# EAGLE design Rainbowduino V3.0b (EAGLE 5.11)
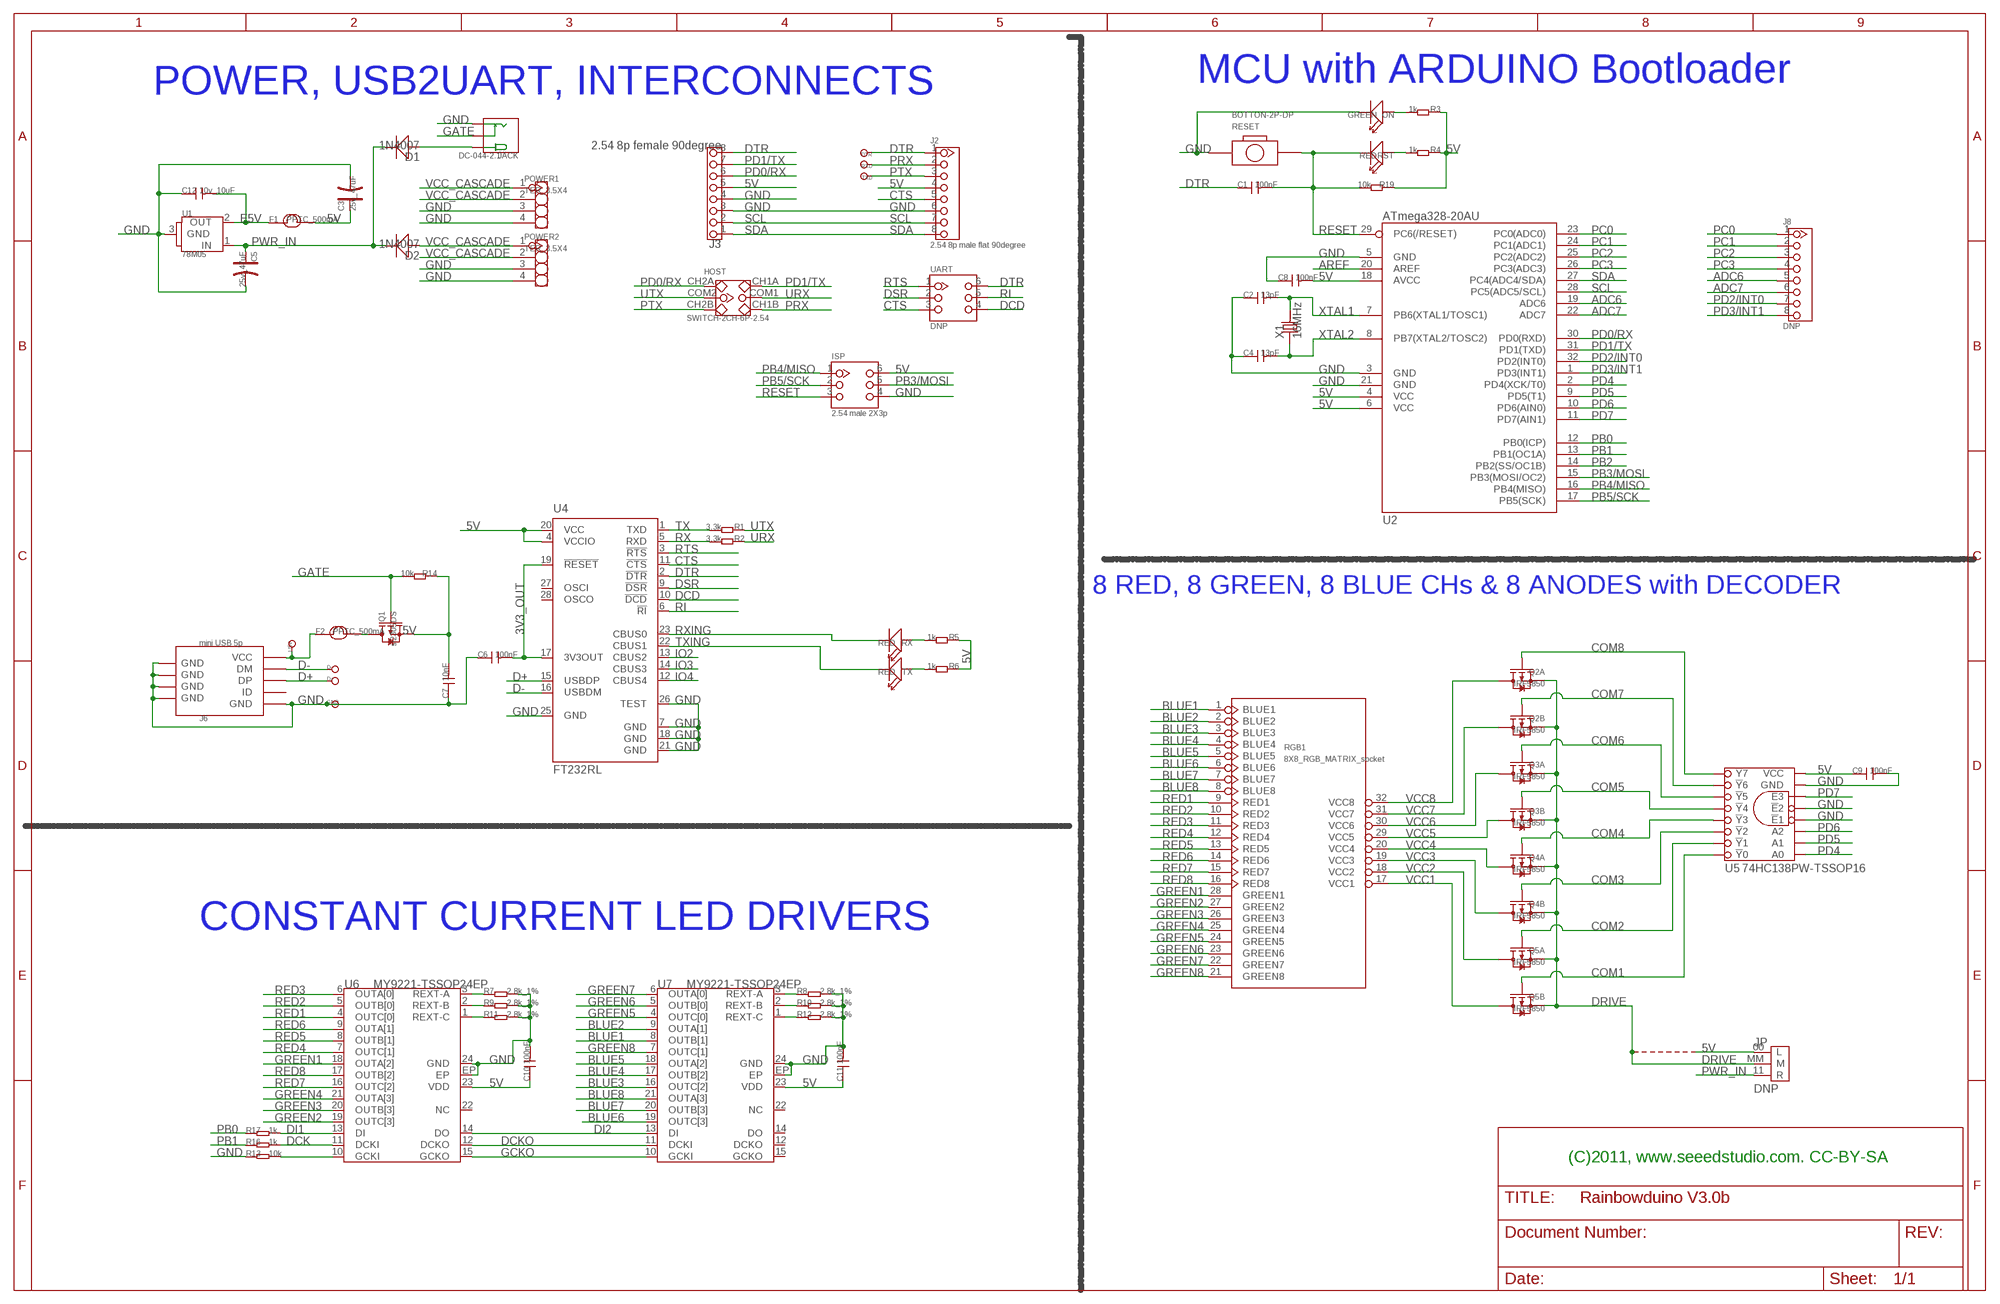
[diagram p0: schematic, sheet 1]

## Parts
C1  100nF  C-0402  [0402]
C2  13pF  C-0402  [0402]
C3  25v_47uF  CAP_ELECTRO_C  [ELECTRO-SMD-C]
C4  13pF  C-0402  [0402]
C5  25v_47uF  CAP_ELECTRO_C  [ELECTRO-SMD-C]
C6  100nF  C-0402  [0402]
C7  10nF  C-0402  [0402]
C8  100nF  C-0402  [0402]
C9  100nF  C-0402  [0402]
C10  100nF  C-0402  [0402]
C11  100nF  C-0402  [0402]
C12  10v_10uF  C-0805  [0805]
D1  1N4007  D-2010  [D2010]
D2  1N4007  D-2010  [D2010]
D+  TEST_POINT_SIZE_3030  [TP_3535]
D-  TEST_POINT_SIZE_3030  [TP_3535]
DTR  TEST_POINT_SIZE_3030  [TP_3535]
F1  PPTC_500mA  FUSE  [1206]
F2  PPTC_500mA  FUSE  [1206]
GND  TEST_POINT_SIZE_3030  [TP_3535]
HOST  SWITCH-2CH-6P-2.54  [2.54SW-2CH]
ISP  2.54 male 2X3p  CK_2X3_DD  [CK_2X3]
J2  2.54 8p male flat 90degree  HEADER-8P-M90  [8P-2.54-MALE-90-LEADED]
J3  2.54 8p female 90degree  8PF90D  [2.54_8P_F90D]
J6  mini USB 5p  USB-MINIUSB-5P_STRONG  [MINI_STRONG]
J8  DNP  HEADER-8P-2.54-LEADED  [8P-2.54-LEADED]
JACK  DC-044-2.1  DC-044  [DC-404]
JP  DNP  PAD-JUMPER-3P40*40  [JUMPER]
ON  GREEN  LED-0603  [D0603]
POWER1  TER_3.5X4  [TER_3.5X4]
POWER2  TER_3.5X4  [TER_3.5X4]
Q1  si2305DS  MOSFET-P-SOT23  [SOT23_]
Q2  IRF5850  DUAL-P-CH-TSOP-6  [TSOP-6]
Q3  IRF5850  DUAL-P-CH-TSOP-6  [TSOP-6]
Q4  IRF5850  DUAL-P-CH-TSOP-6  [TSOP-6]
Q5  IRF5850  DUAL-P-CH-TSOP-6  [TSOP-6]
R1  3.3k  R-0402  [0402]
R2  3.3k  R-0402  [0402]
R3  1k  R-0402  [0402]
R4  1k  R-0402  [0402]
R5  1k  R-0402  [0402]
R6  1k  R-0402  [0402]
R7  2.8k_1%  R-0603  [0603]
R8  2.8k_1%  R-0603  [0603]
R9  2.8k_1%  R-0603  [0603]
R10  2.8k_1%  R-0603  [0603]
R11  2.8k_1%  R-0603  [0603]
R12  2.8k_1%  R-0603  [0603]
R13  10k  R-0402  [0402]
R14  10k  R-0402  [0402]
R16  1k  R-0402  [0402]
R17  1k  R-0402  [0402]
R19  10k  R-0402  [0402]
RESET  BOTTON-2P-DP  [BTN-5.0-RST]
RGB1  8X8_RGB_MATRIX_socket  8X8_RGB_MATRIX  [8X8_RGB_MATRIX]
RST  RED  LED-0603  [D0603]
RX  RED  LED-0603  [D0603]
RXD  TEST_POINT_SIZE_3030  [TP_3535]
TX  RED  LED-0603  [D0603]
TXD  TEST_POINT_SIZE_3030  [TP_3535]
U1  78M05  78M05-TO252  [TO252]
U2  ATmega328-20AU  ATMEGA168  [TQFP32]
U4  FT232RL  [SSOP28]
U5  74HC138PW-TSSOP16  [TSSOP16]
U5V  TEST_POINT_SIZE_3030  [TP_3535]
U6  MY9221-TSSOP24EP  [TSSOP24EP]
U7  MY9221-TSSOP24EP  [TSSOP24EP]
UART  DNP  CK_2X3_DD  [CK_2X3]
X1  16MHz  CRYSTAL-5032  [5032]

## Nets
3V3_OUT: C6.2 U4.17(3V3OUT) U4.19(!RESET)
5V: C3.+ C7.2 C8.2 C9.1 C10.1 C11.1 F1.2 ISP.6 J2.4 J3.5 JP.00(L) Q1.2(S) R3.1 R4.1 R5.1 R6.1 R14.1 R19.1 U2.4(VCC) U2.6(VCC) U2.18(AVCC) U4.4(VCCIO) U4.20(VCC) U5.16(VCC) U6.23(VDD) U7.23(VDD)
ADC6: J8.5 U2.19(ADC6)
ADC7: J8.6 U2.22(ADC7)
AREF: U2.20(AREF)
BLUE1: RGB1.1(BLUE1) U7.8(OUTB[1])
BLUE2: RGB1.2(BLUE2) U7.9(OUTA[1])
BLUE3: RGB1.3(BLUE3) U7.16(OUTC[2])
BLUE4: RGB1.4(BLUE4) U7.17(OUTB[2])
BLUE5: RGB1.5(BLUE5) U7.18(OUTA[2])
BLUE6: RGB1.6(BLUE6) U7.19(OUTC[3])
BLUE7: RGB1.7(BLUE7) U7.20(OUTB[3])
BLUE8: RGB1.8(BLUE8) U7.21(OUTA[3])
COM1: Q5.3(B:G) U5.15(!Y!0)
COM2: Q5.1(A:G) U5.14(!Y!1)
COM3: Q4.3(B:G) U5.13(!Y!2)
COM4: Q4.1(A:G) U5.12(!Y!3)
COM5: Q3.3(B:G) U5.11(!Y!4)
COM6: Q3.1(A:G) U5.10(!Y!5)
COM7: Q2.3(B:G) U5.9(!Y!6)
COM8: Q2.1(A:G) U5.7(!Y!7)
CTS: J2.5 U4.11(!CTS) UART.3
D+: D+.T J6.3(DP) U4.15(USBDP)
D-: D-.T J6.2(DM) U4.16(USBDM)
DCD: U4.10(!DCD) UART.4
DCK: R16.2 U6.11(DCKI)
DCKO: U6.12(DCKO) U7.11(DCKI)
DI1: R17.2 U6.13(DI)
DI2: U6.14(DO) U7.13(DI)
DRIVE: JP.MM(M) Q2.2(B:S) Q2.5(A:S) Q3.2(B:S) Q3.5(A:S) Q4.2(B:S) Q4.5(A:S) Q5.2(B:S) Q5.5(A:S)
DSR: U4.9(!DSR) UART.2
DTR: C1.1 DTR.T J2.1 J3.8 U4.2(!DTR) UART.6
E5V: C12.2 F1.1 U1.2(OUT)
GATE: JACK.CDN Q1.1(G) R14.2
GCKO: U6.15(GCKO) U7.10(GCKI)
GND: C2.1 C3.- C4.1 C5.- C6.1 C7.1 C8.1 C9.2 C10.2 C11.2 C12.1 GND.T ISP.4 J2.6 J3.3 J3.4 J6.5(GND) J6.GND@1(GND) J6.GND@2(GND) J6.GND@3(GND) J6.GND@4(GND) JACK.- ON.- POWER1.3 POWER1.4 POWER2.3 POWER2.4 R7.2 R8.2 R9.2 R10.2 R11.2 R12.2 R13.1 RESET.P$1 U1.3(GND) U2.3(GND) U2.5(GND) U2.21(GND) U4.7(GND) U4.18(GND) U4.21(GND) U4.25(GND) U4.26(TEST) U5.4(!E!1) U5.5(!E!2) U5.8(GND) U6.24(GND) U6.EP U7.24(GND) U7.EP
GREEN1: RGB1.28(GREEN1) U6.18(OUTA[2])
GREEN2: RGB1.27(GREEN2) U6.19(OUTC[3])
GREEN3: RGB1.26(GREEN3) U6.20(OUTB[3])
GREEN4: RGB1.25(GREEN4) U6.21(OUTA[3])
GREEN5: RGB1.24(GREEN5) U7.4(OUTC[0])
GREEN6: RGB1.23(GREEN6) U7.5(OUTB[0])
GREEN7: RGB1.22(GREEN7) U7.6(OUTA[0])
GREEN8: RGB1.21(GREEN8) U7.7(OUTC[1])
IO2: U4.13(CBUS2)
IO3: U4.14(CBUS3)
IO4: U4.12(CBUS4)
N$1: D1.+ JACK.+
N$4: R13.2 U6.10(GCKI)
N$5: R6.2 TX.+
N$6: R5.2 RX.+
N$7: R11.1 U6.1(REXT-C)
N$8: R9.1 U6.2(REXT-B)
N$9: R7.1 U6.3(REXT-A)
N$11: R12.1 U7.1(REXT-C)
N$12: R10.1 U7.2(REXT-B)
N$13: R8.1 U7.3(REXT-A)
N$15: F2.1 J6.1(VCC) U5V.T
N$16: F2.2 Q1.3(D)
N$17: R4.2 RST.+
N$18: ON.+ R3.2
PB0: R17.1 U2.12(PB0(ICP))
PB1: R16.1 U2.13(PB1(OC1A))
PB2: U2.14(PB2(SS/OC1B))
PB3/MOSI: ISP.5 U2.15(PB3(MOSI/OC2))
PB4/MISO: ISP.1 U2.16(PB4(MISO))
PB5/SCK: ISP.2 U2.17(PB5(SCK))
PC0: J8.1 U2.23(PC0(ADC0))
PC1: J8.2 U2.24(PC1(ADC1))
PC2: J8.3 U2.25(PC2(ADC2))
PC3: J8.4 U2.26(PC3(ADC3))
PD0/RX: HOST.CH2A J3.6 U2.30(PD0(RXD))
PD1/TX: HOST.CH1A J3.7 U2.31(PD1(TXD))
PD2/INT0: J8.7 U2.32(PD2(INT0))
PD3/INT1: J8.8 U2.1(PD3(INT1))
PD4: U2.2(PD4(XCK/T0)) U5.1(A0)
PD5: U2.9(PD5(T1)) U5.2(A1)
PD6: U2.10(PD6(AIN0)) U5.3(A2)
PD7: U2.11(PD7(AIN1)) U5.6(E3)
PRX: HOST.CH1B J2.2 RXD.T
PTX: HOST.CH2B J2.3 TXD.T
PWR_IN: C5.+ D1.- D2.- JP.11(R) U1.1(IN)
RED1: RGB1.9(RED1) U6.4(OUTC[0])
RED2: RGB1.10(RED2) U6.5(OUTB[0])
RED3: RGB1.11(RED3) U6.6(OUTA[0])
RED4: RGB1.12(RED4) U6.7(OUTC[1])
RED5: RGB1.13(RED5) U6.8(OUTB[1])
RED6: RGB1.14(RED6) U6.9(OUTA[1])
RED7: RGB1.15(RED7) U6.16(OUTC[2])
RED8: RGB1.16(RED8) U6.17(OUTB[2])
RESET: C1.2 ISP.3 R19.2 RESET.P$2 RST.- U2.29(PC6(/RESET))
RI: U4.6(!RI) UART.5
RTS: U4.3(!RTS) UART.1
RX: R2.2 U4.5(RXD)
RXING: RX.- U4.23(CBUS0)
SCL: J2.7 J3.2 U2.28(PC5(ADC5/SCL))
SDA: J2.8 J3.1 U2.27(PC4(ADC4/SDA))
TX: R1.2 U4.1(TXD)
TXING: TX.- U4.22(CBUS1)
URX: HOST.COM1 R2.1
UTX: HOST.COM2 R1.1
VCC1: Q5.4(B:D) RGB1.17(VCC1)
VCC2: Q5.6(A:D) RGB1.18(VCC2)
VCC3: Q4.4(B:D) RGB1.19(VCC3)
VCC4: Q4.6(A:D) RGB1.20(VCC4)
VCC5: Q3.4(B:D) RGB1.29(VCC5)
VCC6: Q3.6(A:D) RGB1.30(VCC6)
VCC7: Q2.4(B:D) RGB1.31(VCC7)
VCC8: Q2.6(A:D) RGB1.32(VCC8)
VCC_CASCADE: D2.+ POWER1.1 POWER1.2 POWER2.1 POWER2.2
XTAL1: C2.2 U2.7(PB6(XTAL1/TOSC1)) X1.2
XTAL2: C4.2 U2.8(PB7(XTAL2/TOSC2)) X1.1
Unconnected: J6.4(ID) U4.27(OSCI) U4.28(OSCO) U6.22(NC) U7.12(DCKO) U7.14(DO) U7.15(GCKO) U7.22(NC)

## Notes on the sheet
- POWER, USB2UART, INTERCONNECTS | MCU with ARDUINO Bootloader
- 8 RED, 8 GREEN, 8 BLUE CHs & 8 ANODES with DECODER
- CONSTANT CURRENT LED DRIVERS
- (C)2011, www.seeedstudio.com. CC-BY-SA

## Library data of the parts
C1 C2 C4 C6-C12 = Discrete:C*: Ceramic Capacitors
C3 C5 = Discrete:CAP*: Electrolytic Capacitors,Tantalum Capacitors and Super Capacitors
D1 D2 = Discrete:D*
D+ D- DTR GND RXD TXD U5V = For_Test_Albert:TEST_POINT
F1 F2 = Discrete:FUSE
HOST = Discrete:SWITCH-2CH-6P
ISP UART = CONNECTER:CK_2X3
J2 J8 = Connector:HEADER-8P
J3 = For_Test_Albert:8P
J6 = Connector:USB-MINIUSB-5P
JACK = Connector:DC-044
JP = Discrete:PAD-JUMPER-3P
ON RST RX TX = Discrete:LED*
POWER1 POWER2 = CONNECTER:TER_3.5X4
Q1 = Discrete:MOSFET-P: Si2305DS Si2323CDS
Q2-Q5 = For_Test_Albert:DUAL-P-CH: NTGD4161 --> http://www.onsemi.cn/pub_link/Collateral/NTGD4161P-D.PDF Si3993DV --> http://www.vishay.com/docs/72320/72320.pdf
R1-R14 R16 R17 R19 = Discrete:R*
RESET = Discrete:BOTTON-2P
RGB1 = EXT_moudle:8X8_RGB_MATRIX
U1 = IC:78M05: http://search.digikey.com/scripts/DkSearch/dksus.dll?Detail&name=MC78M05CDTXTR-ND
U2 = IC:ATMEGA168
U4 = IC_SMD:FT232R: Source: http://www.ftdichip.com/Documents/DataSheets/DS_FT232R_v104.pdf
U5 = For_Test_Albert:74HC138*
U6 U7 = For_Test_Albert:MY9221
X1 = Discrete:CRYSTAL*: CRYSTAL

## Net classes
0 default: width 0.203 mm, drill 0.305 mm, clearance 0.152 mm

## Board
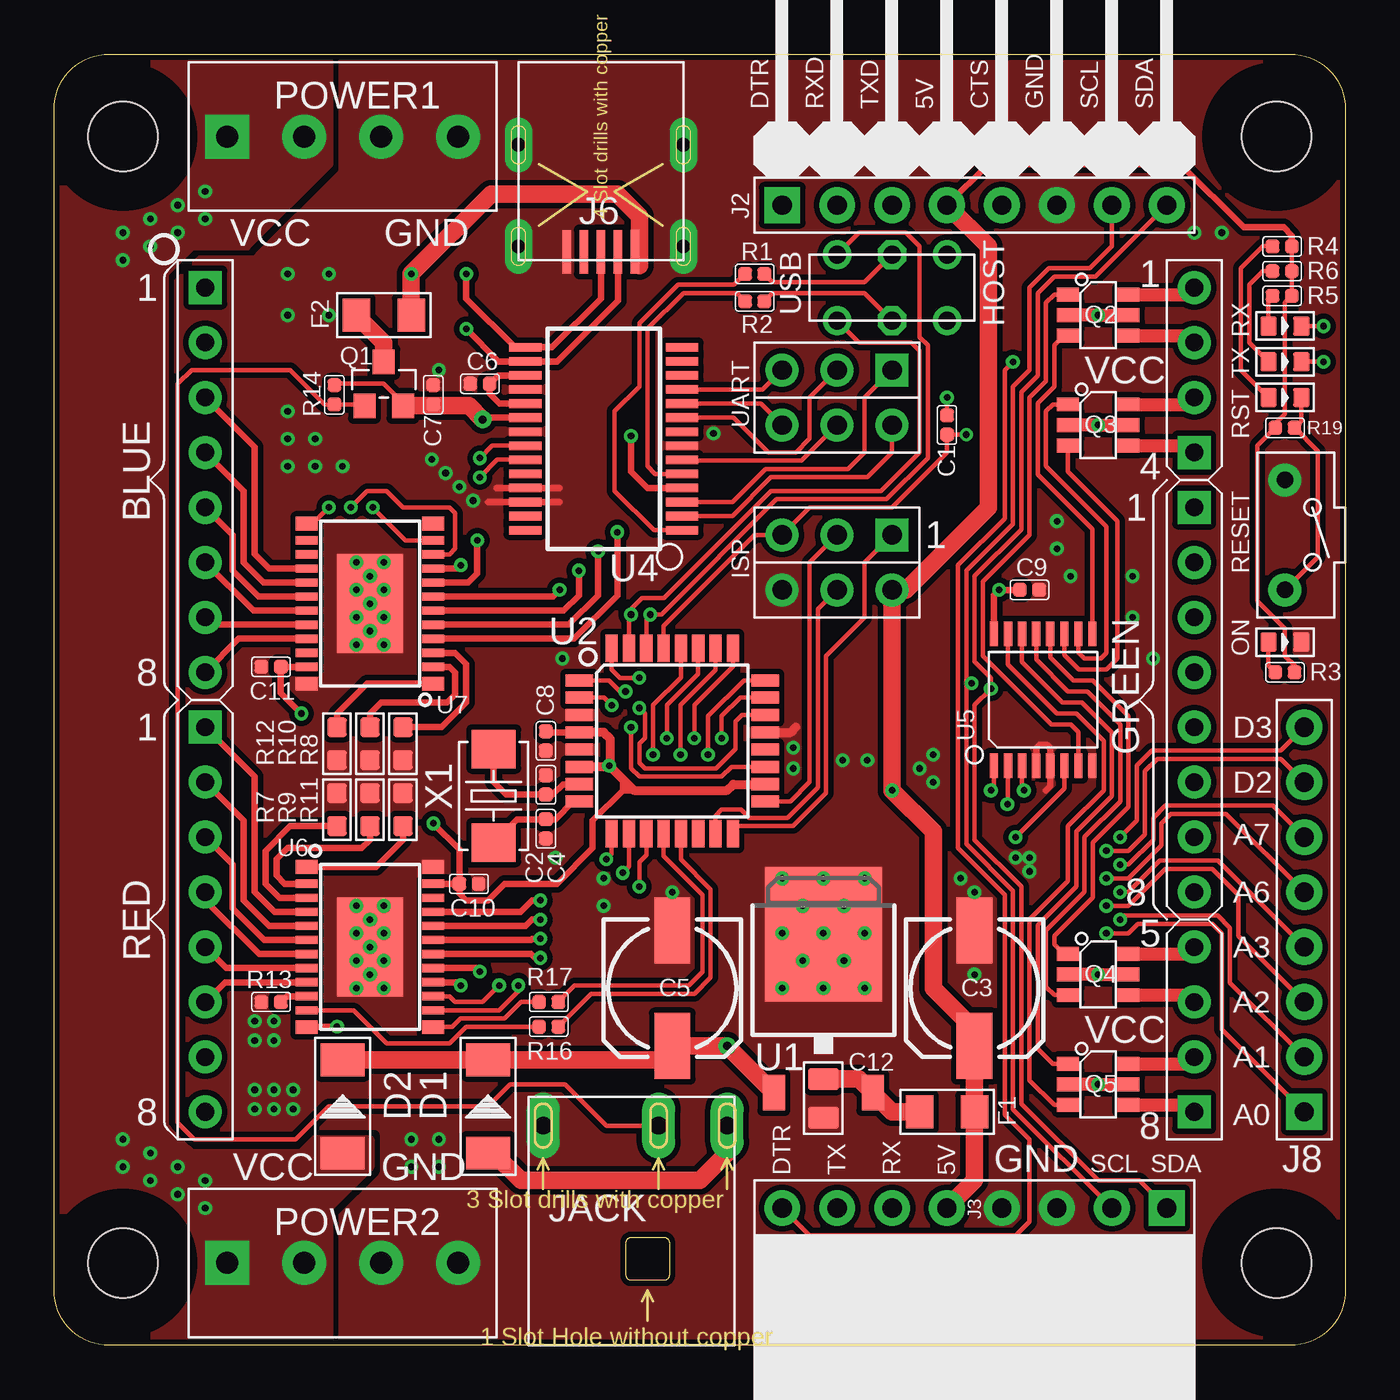
[diagram p1: board, top side]
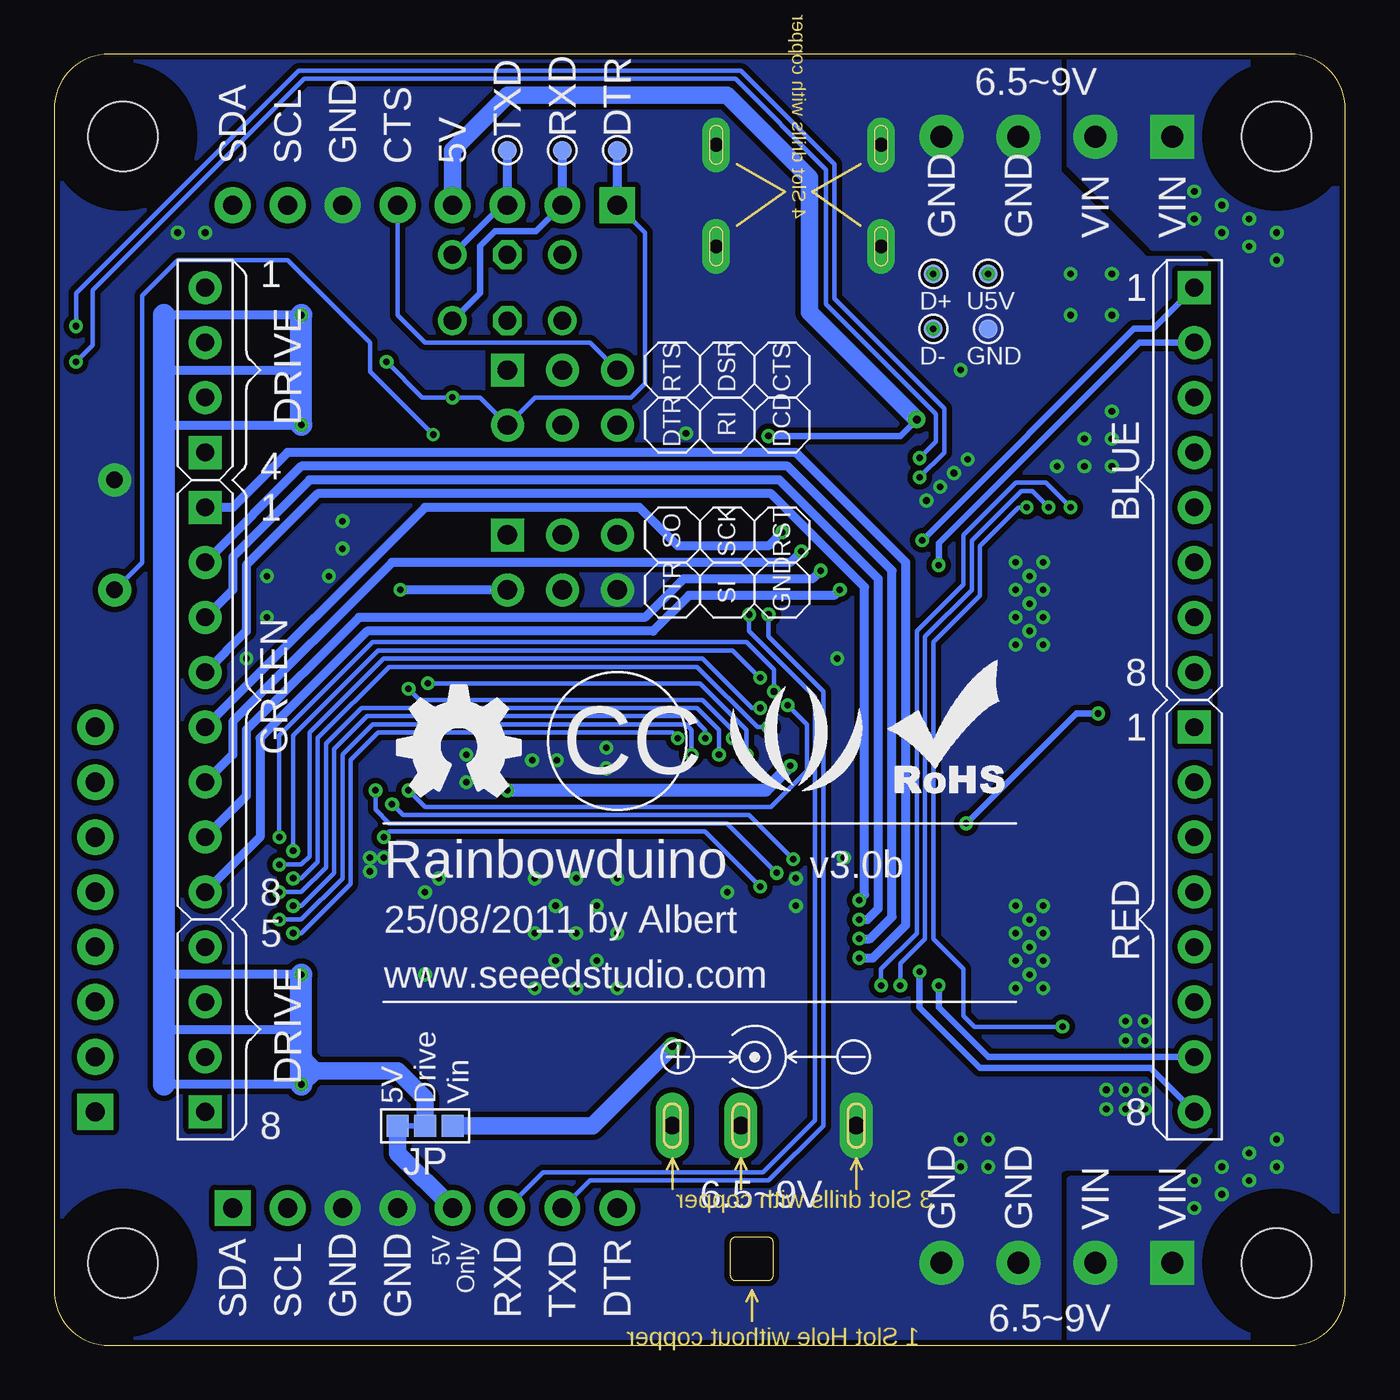
[diagram p2: board, bottom side, seen from below]

Size 59.69 x 59.69 mm. Coordinates in mm from the lower left corner, seen from the top.
Copper layers (1*16): Top 0.035mm / dielectric 1.5mm / Bottom 0.035mm
Design rules "SeeedStudio_rule_no_angle_090911 *": minimum track width 0.0025mm, minimum drill 10mil, track to track 6mil, track to pad 6mil, pad to pad 6mil, via to via 6mil, smd to smd 0mil, copper to edge 10mil, drill to drill 10mil, minimum pad ring 10mil, minimum via ring 6mil, stop-mask expansion 2mil, vias tented up to drill 100mil, thermal gap 10mil
Holes 3.2 mm at 3.17,55.88 56.52,55.88 56.52,3.81 3.17,3.81
tRestrict: area 0,52.7 to 6.3,59.1; area 0,0.6 to 6.3,7; area 53.3,0.6 to 59.7,7; area 53.3,52.7 to 59.7,59.1; area 21,38.7 to 22.5,39.9; area 45.6,26.3 to 45.8,27.3
bRestrict: area 0,52.7 to 6.3,59.1; area 0,0.6 to 6.3,7; area 53.3,0.6 to 59.7,7; area 53.3,52.7 to 59.7,59.1

### Footprints (pad centres in the part's own frame; a part is rotated, then mirrored left to right if it is on the bottom)
0402 = smd 0.635 x 0.635: 1 -0.445,0; 2 0.445,0
ELECTRO-SMD-C = smd 3.048 x 1.651: + 2.667,0; - -2.667,0
0805 = smd 1.016 x 1.397: 1 -0.889,0; 2 0.889,0
D2010 = smd 1.524 x 2.032: + -2.159,0; - 2.159,0
TP_3535 = smd 0.889 x 0.889: T 0,0
1206 = smd 1.27 x 1.524: 1 -1.27,0; 2 1.27,0
2.54SW-2CH = drill 0.813 pad 1.27 round: CH1A -1.524,2.54; CH1B -1.524,-2.54; CH2A 1.524,2.54; CH2B 1.524,-2.54 | drill 0.813 pad 1.27 octagon: COM1 -1.524,0; COM2 1.524,0
CK_2X3 = drill 0.889 pad 1.524 square: 1 -1.27,2.54 | drill 0.889 pad 1.524 round: 2 -1.27,0; 3 -1.27,-2.54; 4 1.27,-2.54; 5 1.27,0; 6 1.27,2.54
8P-2.54-MALE-90-LEADED = drill 0.889 pad 1.651 square: 1 0,8.89 | drill 0.889 pad 1.651 round: 2 0,6.35; 3 0,3.81; 4 0,1.27; 5 0,-1.27; 6 0,-3.81; 7 0,-6.35; 8 0,-8.89
2.54_8P_F90D = drill 0.889 pad 1.651 square: 1 0,8.89 | drill 0.889 pad 1.651 round: 2 0,6.35; 3 0,3.81; 4 0,1.27; 5 0,-1.27; 6 0,-3.81; 7 0,-6.35; 8 0,-8.89
MINI_STRONG = smd 2.032 x 0.406: 1 0.381,-1.575; 2 0.381,-0.787; 3 0.381,0; 4 0.381,0.787; 5 0.381,1.575 | drill 0.635 pad 1.27 long: GND@1 0.635,3.81; GND@2 5.334,3.81; GND@3 5.334,-3.81; GND@4 0.635,-3.81
8P-2.54-LEADED = drill 0.889 pad 1.651 square: 1 0,8.89 | drill 0.889 pad 1.651 round: 2 0,6.35; 3 0,3.81; 4 0,1.27; 5 0,-1.27; 6 0,-3.81; 7 0,-6.35; 8 0,-8.89
DC-404 = drill 0.813 pad 1.524 long: + 3.175,10.16; - -5.334,10.16; CDN 0,10.16
JUMPER = smd 1.016 x 1.016: 00 -1.27,0; 11 1.27,0; MM 0,0
D0603 = smd 0.762 x 0.889: + -0.762,0; - 0.762,0
TER_3.5X4 = drill 1.016 pad 2.032 square: 1 0,5.334 | drill 1.016 pad 2.032 round: 2 0,1.778; 3 0,-1.778; 4 0,-5.334
SOT23_ = smd 1.016 x 1.143: 1 -0.889,-1.016; 2 0.889,-1.016; 3 0,1.016
TSOP-6 = smd 0.635 x 1.016: 1 -0.95,-1.397; 2 0,-1.397; 3 0.95,-1.397; 4 0.95,1.397; 5 0,1.397; 6 -0.95,1.397
0603 = smd 0.889 x 0.889: 1 -0.762,0; 2 0.762,0
BTN-5.0-RST = drill 0.762 pad 1.524 round: P$1 0,2.54; P$2 0,-2.54
8X8_RGB_MATRIX = drill 0.813 pad 1.524 square: 1 6.985,48.895; 9 6.985,28.575; 17 52.705,10.795; 28 52.705,38.735; 29 52.705,41.275 | drill 0.813 pad 1.524 round: 2 6.985,46.355; 3 6.985,43.815; 4 6.985,41.275; 5 6.985,38.735; 6 6.985,36.195; 7 6.985,33.655; 8 6.985,31.115; 10 6.985,26.035; 11 6.985,23.495; 12 6.985,20.955; 13 6.985,18.415; 14 6.985,15.875; 15 6.985,13.335; 16 6.985,10.795; 18 52.705,13.335; 19 52.705,15.875; 20 52.705,18.415; 21 52.705,20.955; 22 52.705,23.495; 23 52.705,26.035; 24 52.705,28.575; 25 52.705,31.115; 26 52.705,33.655; 27 52.705,36.195; 30 52.705,43.815; 31 52.705,46.355; 32 52.705,48.895
TO252 = smd 1.016 x 1.651: 1 -2.286,-4.826; 2 2.286,-4.826 | smd 5.4 x 6.2: 3 0,2.5
TQFP32 = smd 1.27 x 0.559: 1 -4.293,2.8; 2 -4.293,2; 3 -4.293,1.2; 4 -4.293,0.4; 5 -4.293,-0.4; 6 -4.293,-1.2; 7 -4.293,-2; 8 -4.293,-2.8; 17 4.293,-2.8; 18 4.293,-2; 19 4.293,-1.2; 20 4.293,-0.4; 21 4.293,0.4; 22 4.293,1.2; 23 4.293,2; 24 4.293,2.8 | smd 0.559 x 1.27: 9 -2.8,-4.293; 10 -2,-4.293; 11 -1.2,-4.293; 12 -0.4,-4.293; 13 0.4,-4.293; 14 1.2,-4.293; 15 2,-4.293; 16 2.8,-4.293; 25 2.8,4.293; 26 2,4.293; 27 1.2,4.293; 28 0.4,4.293; 29 -0.4,4.293; 30 -1.2,4.293; 31 -2,4.293; 32 -2.8,4.293
SSOP28 = smd 0.4 x 1.5: 1 -4.225,-3.625; 2 -3.575,-3.625; 3 -2.925,-3.625; 4 -2.275,-3.625; 5 -1.625,-3.625; 6 -0.975,-3.625; 7 -0.325,-3.625; 8 0.325,-3.625; 9 0.975,-3.625; 10 1.625,-3.625; 11 2.275,-3.625; 12 2.925,-3.625; 13 3.575,-3.625; 14 4.225,-3.625; 15 4.225,3.625; 16 3.575,3.625; 17 2.925,3.625; 18 2.275,3.625; 19 1.625,3.625; 20 0.975,3.625; 21 0.325,3.625; 22 -0.325,3.625; 23 -0.975,3.625; 24 -1.625,3.625; 25 -2.275,3.625; 26 -2.925,3.625; 27 -3.575,3.625; 28 -4.225,3.625
TSSOP16 = smd 0.381 x 1.143: 1 -2.275,-3.045; 2 -1.625,-3.045; 3 -0.975,-3.045; 4 -0.325,-3.045; 5 0.325,-3.045; 6 0.975,-3.045; 7 1.625,-3.045; 8 2.275,-3.045; 9 2.275,3.045; 10 1.625,3.045; 11 0.975,3.045; 12 0.325,3.045; 13 -0.325,3.045; 14 -0.975,3.045; 15 -1.625,3.045; 16 -2.275,3.045
TSSOP24EP = smd 0.635 x 1.016: 1 -3.702,-2.921; 12 3.702,-2.921; 13 3.702,2.921; 24 -3.702,2.921 | smd 0.381 x 1.016: 2 -2.925,-2.921; 3 -2.275,-2.921; 4 -1.625,-2.921; 5 -0.975,-2.921; 6 -0.325,-2.921; 7 0.325,-2.921; 8 0.975,-2.921; 9 1.625,-2.921; 10 2.275,-2.921; 11 2.925,-2.921; 14 2.925,2.921; 15 2.275,2.921; 16 1.625,2.921; 17 0.975,2.921; 18 0.325,2.921; 19 -0.325,2.921; 20 -0.975,2.921; 21 -1.625,2.921; 22 -2.275,2.921; 23 -2.925,2.921 | smd 4.572 x 3.048: EP 0,0
5032 = smd 1.778 x 2.032: 1 -2.159,0; 2 2.159,0

### Placement (x,y rotation side)
C1  41.27,42.55 270 top
C2  22.73,25.91 270 top
C3  42.55,16.51 270 top
C4  22.73,23.88 90 top
C5  28.57,16.51 270 top
C6  19.68,44.45 0 top
C7  17.53,43.94 270 top
C8  22.73,27.94 90 top
C9  45.09,34.92 0 top
C10  19.18,21.34 0 top
C11  10.03,31.37 180 top
C12  35.56,11.43 90 top
D1  20.07,11.05 90 top
D2  13.34,11.05 90 top
D+  19.05,49.53 0 bottom
D-  19.05,46.99 0 bottom
DTR  33.66,55.24 90 bottom
F1  41.27,10.79 0 top
F2  15.24,47.62 180 top
GND  16.51,46.99 0 bottom
HOST  38.73,48.9 90 top
ISP  36.2,36.2 270 top
J2  42.55,52.7 90 top
J3  42.55,6.35 270 top
J6  25.27,50.16 90 top
J8  57.78,19.68 180 top
JACK  27.94,0 0 top
JP  42.55,10.16 0 bottom
ON  56.9,32.51 0 top
POWER1  13.34,55.88 90 top
POWER2  13.34,3.81 90 top
Q1  15.24,44.45 0 top
Q2  48.26,47.62 270 top
Q3  48.26,42.55 270 top
Q4  48.26,17.14 270 top
Q5  48.26,12.06 270 top
R1  32.38,49.53 180 top
R2  32.38,48.26 180 top
R3  56.9,31.11 180 top
R4  56.77,50.8 180 top
R5  56.77,48.51 180 top
R6  56.77,49.66 180 top
R7  13.08,24.77 90 top
R8  16.13,27.81 270 top
R9  14.61,24.77 90 top
R10  14.61,27.81 270 top
R11  16.13,24.77 90 top
R12  13.08,27.81 270 top
R13  10.03,15.88 0 top
R14  12.95,43.94 270 top
R16  22.86,14.73 180 top
R17  22.86,15.88 180 top
R19  56.9,42.42 0 top
RESET  56.9,37.47 0 top
RGB1  0,0 0 top
RST  56.9,43.81 0 top
RX  56.9,47.12 0 top
RXD  36.2,55.24 90 bottom
TX  56.9,45.47 0 top
TXD  38.73,55.24 90 bottom
U1  35.56,16.51 0 top
U2  28.57,27.94 0 top
U4  25.4,41.91 90 top
U5  45.72,29.84 0 top
U5V  16.51,49.53 0 bottom
U6  14.61,18.41 270 top
U7  14.61,34.29 90 top
U$1  [OSHW_FILLX200_NOTEXT]  43.81,25.4 0 bottom
U$2  [LOGO_SILK]  25.4,27.3 0 bottom
U$3  [ROHS_SILK]  19.05,27.94 0 bottom
UART  36.2,43.81 270 top
X1  20.32,25.4 90 top

### Tracks (layer width: path | path; a pad name or v marks a point on that pad's centre or on a via)
3V3_OUT
  Top 0.305: U4.17 20.52,44.84 C6.2 20.13,44.01 20.6,43.53 U4.19
5V  (via drill 0.3 pad 0.64, 0.38 pad 0.81)
  Top 0.203: R4.1 R6.1 R5.1 56.9,48.2 56.9,43.05 56.45,42.61 R19.1 55.63,41.59 55.63,34.42 56.9,33.15 56.9,31.88 57.34,31.43 R3.1 | Q1.2 16.13,43.56 15.24,44.45 13.02,44.45 R14.1 | 17.53,43.43 C7.2
  Top 0.305: U5.16 43.45,34.68 v43.69,34.92 C9.1 | U7.23 C11.1 10.48,30.16 v11.43,29.21 | U2.4 22.78,28.34 | 22.78,28.34 C8.2 | 22.78,28.34 22.71,28.34 | U6.23 C10.1 | v17.53,24.13 18.73,22.92 C10.1 | 26.54,25.65 26.8,25.65 | 26.29,25.65 26.54,25.65 | 26.54,25.65 26.54,25.91 26.29,26.16 26.29,25.65 | 26.29,25.65 24.89,24.26 24.89,22.99 23.24,21.34 20.83,21.34 20.07,20.57 19.05,20.57 18.73,20.89 C10.1 | R4.1 57.21,51.31 56.83,51.69 54.99,51.69 52.07,54.61 43.18,54.61 J2.4 | U4.4 27.42,39.63 26.67,40.39 v26.67,42.04 | U4.20 19.9,42.88 v19.81,42.8
  Top 0.406: U2.4 25.4,28.34 25.71,28.03 25.71,26.74 | U2.18 31.4,25.94 31.11,25.65 26.8,25.65 25.71,26.74 | 25.71,26.74 U2.6 | 25.71,26.74 v25.65,26.8
  Top 0.813: J3.5 42.55,7.62 F1.2 C3.+ 42.55,14.61 40.64,16.51 40.64,23.75 v38.73,25.65 ISP.6 39.37,34.92 43.18,38.73 43.18,50.8 J2.4 | Q1.2 17.53,43.43 19.18,43.43 v19.81,42.8
  Bottom 0.305: v11.43,29.21 12.45,29.21 v17.53,24.13 | v26.67,42.04 20.57,42.04 v19.81,42.8
  Bottom 0.406: ISP.6 v43.69,34.92
  Bottom 0.61: v38.73,25.65 26.8,25.65 v25.65,26.8
  Bottom 0.813: JP.00 43.81,8.89 J3.5 | J2.4 41.27,55.24 38.73,57.78 28.57,57.78 24.77,53.98 24.77,47.75 v19.81,42.8
  pour Top: -5.08,57.15 -3.81,57.15 -3.81,55.88 -5.08,55.88
ADC6  (via drill 0.3 pad 0.64)
  Top 0.203: J8.5 54.17,24.57 51.63,24.57 51.18,24.13 51.18,23.11 49.66,21.59 v48.64,21.59 | U2.19 31.31,26.74 30.86,26.29 27.05,26.29 26.67,26.67 v26.67,28.57
  Bottom 0.203: v26.67,28.57 27.18,28.57 29.97,31.37 44.2,31.37 47.5,28.07 47.5,22.35 48.26,21.59 v48.64,21.59
ADC7  (via drill 0.3 pad 0.64)
  Top 0.203: J8.6 56.33,24.96 51.37,24.96 50.8,24.38 50.8,23.37 49.66,22.23 v49.28,22.23 | U2.22 31.81,29.14 31.5,28.83 31.5,27.56 30.61,26.67 27.3,26.67 27.05,26.92 27.05,27.81 27.3,28.07 27.3,29.21 v27.05,29.46
  Bottom 0.203: v27.05,29.46 27.43,29.46 29.72,31.75 44.45,31.75 47.88,28.32 47.88,22.61 48.26,22.23 v49.28,22.23
BLUE1  (via drill 0.3 pad 0.64)
  Top 0.305: U7.8 19.14,35.27 19.56,35.69 v19.56,37.21
  Bottom 0.305: RGB1.1 8.89,46.99 9.78,46.99 v19.56,37.21
BLUE2  (via drill 0.3 pad 0.64)
  Top 0.305: U7.9 18.64,35.91 v18.8,36.07
  Bottom 0.305: RGB1.2 9.53,46.35 18.8,37.08 v18.8,36.07
BLUE3
  Top 0.305: U7.16 9.93,35.91 9.27,36.58 9.27,41.53 RGB1.3
BLUE4
  Top 0.305: U7.17 9.69,35.27 8.76,36.2 8.76,39.5 RGB1.4
BLUE5
  Top 0.305: U7.18 9.45,34.62 8.26,35.81 8.26,37.47 RGB1.5
BLUE6
  Top 0.305: U7.19 9.21,33.97 RGB1.6
BLUE7
  Top 0.305: U7.20 7.33,33.31 RGB1.7
BLUE8
  Top 0.305: U7.21 8.54,32.66 RGB1.8
COM1
  Top 0.203: U5.15 44.09,31.47 46.35,29.21 47.24,29.21 48.51,27.94 48.51,25.65 46.86,24 46.86,21.46 45.09,19.68 45.09,12.26 46.23,11.12 Q5.3
COM2
  Top 0.203: U5.14 44.74,31.58 46.61,29.72 47.5,29.72 48.9,28.32 48.9,25.4 47.24,23.75 47.24,21.21 45.47,19.43 45.47,13.72 46.17,13.02 Q5.1
COM3
  Top 0.203: U5.13 45.4,31.69 46.86,30.23 47.75,30.23 49.28,28.7 49.28,25.15 47.62,23.5 47.62,20.95 45.85,19.18 45.85,16.57 46.23,16.2 Q4.3
COM4
  Top 0.203: U5.12 46.05,31.81 47.12,30.73 48.01,30.73 49.66,29.08 49.66,24.89 48.01,23.24 48.01,20.7 46.23,18.92 46.23,18.54 46.67,18.09 Q4.1
COM5
  Top 0.203: U5.11 46.7,31.92 47.37,31.24 48.64,31.24 49.15,31.75 49.15,38.1 46.86,40.39 Q3.3
COM6
  Top 0.203: U5.10 47.34,32.03 47.62,31.75 48.39,31.75 48.64,32 48.64,37.85 45.85,40.64 45.85,43.18 46.16,43.49 Q3.1
COM7
  Top 0.203: U5.9 47.99,37.73 45.47,40.26 45.47,43.56 46.23,44.32 46.23,46.23 46.67,46.67 Q2.3
COM8
  Top 0.203: U5.7 47.34,28.35 46.99,28.7 46.1,28.7 42.93,31.88 42.93,35.31 45.09,37.47 45.09,43.81 45.85,44.58 45.85,48.2 46.23,48.58 Q2.1
CTS
  Top 0.203: U4.11 32.76,44.19 UART.3
  Bottom 0.203: UART.3 34.92,46.35 42.55,46.35 43.81,47.62 J2.5
D+  (via drill 0.3 pad 0.64)
  Top 0.305: J6.3 25.27,48.39 23.02,46.13 U4.15 21.3,46.13 19.05,48.39 D+.T
  other vias: 19.05,49.53
D-  (via drill 0.3 pad 0.64)
  Top 0.305: J6.2 26.06,48.28 23.26,45.48 U4.16 20.55,45.48 D-.T
  other vias: 19.05,46.99
DCD
  Top 0.203: U4.10 32.66,43.53 UART.4
DCK
  Top 0.203: U6.11 13.85,15.49 15.37,13.97 18.29,13.97 19.05,14.73 R16.2
DCKO  (via drill 0.3 pad 0.64)
  Top 0.203: U7.11 16.25,37.22 v14.73,38.73
  Top 0.305: U6.12 13.06,14.71 v13.08,14.73
  Bottom 0.203: v14.73,38.73 15.11,38.73 16.89,36.96 16.89,34.67 19.05,32.51 19.05,18.8 17.65,17.4 17.65,15.24 17.14,14.73 v13.08,14.73
DI1
  Top 0.203: U6.13 18.4,14.71 18.8,15.11 20.83,15.11 21.59,15.88 R17.2
DI2  (via drill 0.3 pad 0.64)
  Top 0.203: U7.13 11.96,37.99 v12.7,38.73 | U6.14 20.57,15.49 21.46,16.38 v21.46,16.64
  Bottom 0.203: v12.7,38.73 13.84,39.88 15.24,39.88 17.65,37.47 17.65,35.18 19.81,33.02 19.81,19.05 21.46,17.4 v21.46,16.64
DRIVE  (via drill 0.3 pad 0.64)
  Top 0.61: Q3.2 v48.26,42.55 Q3.5 | Q2.2 v48.26,47.62 Q2.5 | Q4.2 v48.26,17.14 Q4.5 | Q5.2 v48.26,12.06 Q5.5
  Bottom 0.254: JP.MM 43.81,10.16
  Bottom 0.406: v48.26,47.62 54.61,47.62 | 54.61,45.09 48.26,45.09 | 54.61,14.61 48.26,14.61 | v48.26,17.14 54.61,17.14 | 54.61,42.55 v48.26,42.55 | v48.26,12.06 54.61,12.06
  Bottom 0.813: JP.MM 42.55,11.43 43.81,12.7 47.62,12.7 | 47.62,12.7 v48.26,12.06 | 47.62,12.7 48.26,13.34
  Bottom 1.016: v48.26,42.55 v48.26,47.62 | v48.26,12.06 48.26,13.34 v48.26,17.14 | 54.61,47.62 54.61,45.09 54.61,42.55 54.61,17.14 54.61,14.61 54.61,12.06
DSR
  Top 0.203: UART.2 34.92,43.81 34.92,41.91 34.29,41.27 33.02,41.27 31.41,42.88 U4.9
DTR  (via drill 0.3 pad 0.64)
  Top 0.203: J3.8 34.92,5.08 44.45,5.08 45.09,5.71 45.09,9.53 43.94,10.67 43.94,20.83 41.78,22.99 41.78,36.07 43.94,38.23 43.94,45.09 v44.32,45.47 | UART.6 38.73,41.27 37.59,40.13 33.15,40.13 31.35,38.34 U4.2 | v41.27,43.81 C1.1
  Bottom 0.203: J2.1 32.38,51.44 32.38,44.45 33.02,43.81 37.47,43.81 UART.6 40.01,43.81 v41.27,43.81 42.67,43.81 v44.32,45.47
  Bottom 0.406: J2.1 DTR.T
E5V
  Top 0.813: C12.2 37.21,12.32 U1.2 38.73,10.79 F1.1
GATE
  Top 0.203: JACK.CDN 25.53,10.16 23.62,12.06 21.08,12.06 20.07,11.05 12.7,11.05 11.18,9.53 6.48,9.53 5.71,10.29 5.71,44.45 6.35,45.09 10.92,45.09 12.51,43.5 R14.2 14.29,43.5 Q1.1
GCKO  (via drill 0.3 pad 0.64)
  Top 0.203: U6.15 18.28,16.14 18.54,15.88 19.81,15.88 v20.57,16.64 | v13.72,38.73 14.48,39.5 15.37,39.5 16.13,38.73 18.29,38.73 18.54,38.48 18.54,36.83 18.28,36.56 U7.10
  Bottom 0.203: v13.72,38.73 14.48,39.5 14.99,39.5 17.27,37.21 17.27,34.92 19.43,32.77 19.43,18.8 20.57,17.65 v20.57,16.64
GND  (via drill 0.3 pad 0.64)
  Top 0.305: U5.4 45.4,27.61 45.54,27.76 45.9,27.76 46.05,27.61 U5.5 46.05,25.85 45.85,25.65 | 23.36,39.63 U4.25 20.46,39.63 | 23.36,38.98 U4.26 20.07,38.98
  Top 0.406: U2.21 34.05,28.34 34.29,28.57
  other vias: 46.35,38.1 46.35,36.83 46.99,35.56 49.85,35.56 49.85,33.66 50.8,31.75 16.51,8.26 17.78,8.26 17.78,9.53 16.51,9.53 9.27,10.92 10.16,10.92 11.05,10.92 11.05,11.81 10.16,11.81 9.27,11.81 9.27,14.1 10.16,14.1 9.27,14.99 10.16,14.99 13.97,20.32 14.61,19.68 15.24,20.32 15.24,19.05 13.97,19.05 13.97,17.78 15.24,17.78 14.61,18.41 14.61,17.14 13.97,16.51 15.24,16.51 14.61,34.29 13.97,34.92 15.24,34.92 15.24,33.66 13.97,33.66 14.61,35.56 13.97,36.2 15.24,36.2 14.61,33.02 13.97,32.38 15.24,32.38 10.79,43.18 10.79,41.91 12.06,41.91 10.79,40.64 12.06,40.64 13.34,40.64 17.46,40.96 18.1,40.32 18.73,39.69 19.37,39.05 23.18,22.54 25.4,21.59 35.56,16.51 35.56,19.05 35.56,21.59 33.66,21.59 33.66,19.05 33.66,16.51 37.47,16.51 37.47,19.05 37.47,21.59 34.61,20.32 36.51,20.32 36.51,17.78 34.61,17.78 34.16,27.62 34.16,26.67 40.64,27.3 40.64,26.04 40.01,26.67 45.09,22.54 52.7,51.44 53.98,51.44 25.4,20.32 42.55,20.95 42.55,17.14 28.57,20.95 45.09,21.91 44.45,22.54 23.5,31.75 10.79,49.53 10.79,47.62 12.7,49.53 12.7,47.62 17.78,45.09 41.91,21.59 36.45,27.05 37.59,27.05 30.48,42.16
  pour Top: -5.08,59.05 -3.81,59.05 -3.81,57.78 -5.08,57.78
  pour Top (isolate 0.254, rank 6, no thermals): 0,59.69 59.44,59.69 59.69,59.44 59.69,0 0.25,0 0,0.25
  pour Bottom (isolate 0.254, rank 6, no thermals): 0,59.69 59.44,59.69 59.69,59.44 59.69,0 0.25,0 0,0.25
GREEN1  (via drill 0.3 pad 0.64)
  Top 0.305: U6.18 22.04,18.09 22.23,17.91 v22.48,17.91
  Bottom 0.406: RGB1.28 51.44,38.73 48.9,41.27 25.4,41.27 20.32,36.2 20.32,19.43 21.84,17.91 v22.48,17.91
GREEN2  (via drill 0.3 pad 0.64)
  Top 0.305: U6.19 22.04,18.74 22.1,18.8 v22.48,18.8
  Bottom 0.406: RGB1.27 48.26,40.64 25.78,40.64 20.95,35.81 20.95,19.81 21.97,18.8 v22.48,18.8
GREEN3  (via drill 0.3 pad 0.64)
  Top 0.305: U6.20 21.8,19.39 22.1,19.68 v22.48,19.68
  Bottom 0.406: RGB1.26 51.44,34.92 51.44,36.45 47.88,40.01 26.16,40.01 21.59,35.43 21.59,20.19 22.1,19.68 v22.48,19.68
GREEN4  (via drill 0.3 pad 0.64)
  Top 0.305: U6.21 21.56,20.04 22.1,20.57 v22.48,20.57
  Bottom 0.406: RGB1.25 50.8,33.02 50.8,36.07 47.5,39.37 26.54,39.37 22.23,35.05 22.23,20.83 v22.48,20.57
GREEN5  (via drill 0.3 pad 0.64)
  Top 0.305: U7.4 24.03,32.66 26.04,34.67 v26.04,37.59
  Bottom 0.406: RGB1.24 42.55,38.73 32.64,38.73 30.86,36.96 26.67,36.96 v26.04,37.59
GREEN6  (via drill 0.3 pad 0.64)
  Top 0.305: U7.5 23.79,33.31 25.15,34.67 v25.15,36.7
  Bottom 0.406: RGB1.23 51.44,27.3 51.44,28.83 44.07,36.2 25.65,36.2 v25.15,36.7
GREEN7  (via drill 0.3 pad 0.64)
  Top 0.305: U7.6 23.55,33.97 24.26,34.67 v24.26,35.81
  Bottom 0.406: RGB1.22 50.8,25.4 50.8,28.45 45.59,33.66 32.38,33.66 30.61,35.43 24.64,35.43 v24.26,35.81
GREEN8  (via drill 0.3 pad 0.64)
  Top 0.305: U7.7 23.06,34.62 v23.37,34.92
  Bottom 0.406: RGB1.21 50.16,23.5 50.16,28.07 45.21,33.02 32,33.02 30.35,34.67 23.62,34.67 v23.37,34.92
N$1
  Top 0.813: D1.+ 20.32,8.89 21.59,7.62 29.84,7.62 31.11,8.89 JACK.+
N$4
  Top 0.305: U6.10 10.74,16.14 R13.2
N$5
  Top 0.203: TX.+ 55.24,46.35 55.24,49.02 55.88,49.66 R6.2
N$6
  Top 0.203: RX.+ 56.13,48.32 R5.2
N$7
  Top 0.305: U6.1 14.88,22.12 16.13,23.37 R11.1
N$8
  Top 0.305: U6.2 10.66,21.34 10.29,21.72 10.29,22.48 10.79,22.99 14.22,22.99 14.61,23.37 R9.1
N$9
  Top 0.305: U6.3 10.43,20.69 9.78,21.34 9.78,22.86 10.92,24 R7.1
N$11
  Top 0.305: U7.1 14.46,30.59 13.08,29.21 R12.1
N$12
  Top 0.305: U7.2 18.29,31.36 18.54,31.11 18.54,30.1 18.16,29.72 15.11,29.72 14.61,29.21 R10.1
N$13
  Top 0.305: U7.3 18.53,32.02 19.05,31.5 19.05,29.72 17.91,28.57 R8.1
N$15  (via drill 0.3 pad 0.64)
  Top 0.305: 27.05,50.55 J6.1
  Top 0.813: 27.05,49.91 27.05,50.55 27.05,52.2 26.04,53.21 20.19,53.21 U5V.T F2.1
  other vias: 16.51,49.53
N$16
  Top 0.813: Q1.3 15.24,46.35 F2.2
N$17
  Top 0.203: RST.+ 54.86,45.09 54.86,49.78 55.88,50.8 R4.2
N$18
  Top 0.203: ON.+ 56.13,31.43 R3.2
PB0
  Top 0.203: U2.12 28.18,22.62 29.97,20.83 29.97,17.27 29.34,16.64 24.07,16.64 R17.1
PB1
  Top 0.203: R16.1 24.83,16.26 29.59,16.26 30.35,17.02 30.35,21.08 28.98,22.46 U2.13
PB3/MOSI
  Top 0.203: U2.15 30.57,24.48 30.86,24.77 31.75,24.77 32.13,24.38 33.91,24.38 35.31,25.78 35.31,34.04 ISP.5
PB4/MISO
  Top 0.203: ISP.1 37.47,36.2 37.47,33.66 35.69,31.88 35.69,25.53 34.16,24 31.62,24 31.38,23.75 U2.16
PB5/SCK
  Top 0.203: U2.17 34.03,25.14 34.92,26.04 34.92,36.2 ISP.2
PC0  (via drill 0.3 pad 0.64)
  Top 0.203: J8.1 53.98,14.61 53.98,19.05 53.53,19.49 50.1,19.49 49.66,19.05 v48.64,19.05 | U2.23 31.72,29.94 30.86,29.08 v30.86,28.07
  Bottom 0.203: v30.86,28.07 31.11,28.32 44.7,28.32 45.97,27.05 45.97,21.34 48.26,19.05 v48.64,19.05
PC1  (via drill 0.3 pad 0.64)
  Top 0.203: J8.2 54.36,16.76 54.36,19.3 53.78,19.88 49.47,19.88 v49.28,19.68 | U2.24 31.88,30.74 30.23,29.08 v30.23,27.3
  Bottom 0.203: v30.23,27.3 30.23,28.45 30.48,28.7 44.96,28.7 46.35,27.3 46.35,21.59 48.26,19.68 v49.28,19.68
PC2  (via drill 0.3 pad 0.64)
  Top 0.203: J8.3 54.74,18.92 54.74,20.83 53.53,22.04 51.37,22.04 49.66,20.32 v48.64,20.32 | U2.25 31.38,31.38 29.59,29.59 v29.59,28.07
  Bottom 0.203: v29.59,28.07 29.59,28.45 30.23,29.08 45.21,29.08 46.74,27.56 46.74,21.84 48.26,20.32 v48.64,20.32
PC3  (via drill 0.3 pad 0.64)
  Top 0.203: J8.4 53.78,22.42 51.12,22.42 49.66,20.95 v49.28,20.95 | U2.26 30.57,31.21 28.96,29.59 v28.96,27.3
  Bottom 0.203: v28.96,27.3 28.96,28.45 29.97,29.46 45.47,29.46 47.12,27.81 47.12,22.1 48.26,20.95 v49.28,20.95
PD0/RX  (via drill 0.3 pad 0.64)
  Top 0.203: U2.30 27.38,33.6 v27.56,33.78 28.07,33.78 33.4,39.12 38.48,39.12 40.39,41.02 40.39,46.23 40.01,46.61 40.01,50.8 39.37,51.44 37.21,51.44 HOST.CH2A
  Bottom 0.203: v27.56,33.78 27.56,33.02 24.51,29.97 24.51,10.41 26.92,8 37.08,8 J3.6
PD1/TX  (via drill 0.3 pad 0.64)
  Top 0.203: U2.31 26.57,33.69 v26.67,33.78 26.67,34.04 27.18,34.54 28.19,34.54 33.15,39.5 38.23,39.5 40.01,41.27 40.01,45.97 39.62,46.35 37.21,46.35 HOST.CH1A
  Bottom 0.203: v26.67,33.78 26.67,32.77 24.13,30.23 24.13,10.16 26.67,7.62 34.92,7.62 J3.7
PD2/INT0  (via drill 0.3 pad 0.64)
  Top 0.203: J8.7 56.71,27.11 50.99,27.11 50.42,26.54 50.42,23.62 49.66,22.86 v48.64,22.86 | U2.32 25.77,31.25 26.16,30.86 v27.05,30.86
  Bottom 0.203: v27.05,30.86 28.32,32.13 44.7,32.13 48.64,28.19 v48.64,22.86
PD3/INT1  (via drill 0.3 pad 0.64)
  Top 0.203: J8.8 56.71,27.5 50.74,27.5 50.04,26.8 50.04,24.26 v49.28,23.5 | U2.1 25.65,30.74 26.16,30.23 v26.42,30.23
  Bottom 0.203: v26.42,30.23 26.42,31.24 27.69,32.51 44.96,32.51 49.28,28.19 v49.28,23.5
PD4  (via drill 0.3 pad 0.64)
  Top 0.203: U2.2 25.43,29.94 v25.78,29.59 | U5.1 43.45,25.79 v43.31,25.65
  Bottom 0.203: v25.78,29.59 24.89,28.7 24.89,26.54 26.54,24.89 42.55,24.89 v43.31,25.65
PD5  (via drill 0.3 pad 0.64)
  Top 0.203: U2.9 25.77,22.73 v25.53,22.48 | U5.2 44.09,25.05 v44.07,25.02
  Bottom 0.203: v25.53,22.48 27.56,24.51 43.56,24.51 v44.07,25.02
PD6  (via drill 0.3 pad 0.64)
  Top 0.203: U2.10 26.57,22.13 v26.29,21.84 | U5.3 44.74,25.74 v44.83,25.65
  Bottom 0.203: v26.29,21.84 28.57,24.13 44.2,24.13 44.83,24.77 v44.83,25.65
PD7  (via drill 0.3 pad 0.64)
  Top 0.203: U2.11 27.38,22.68 27.05,22.35 v27.05,21.21 | U5.6 46.7,25.74 v44.45,23.5
  Bottom 0.203: v27.05,21.21 29.59,23.75 44.2,23.75 v44.45,23.5
PRX
  Bottom 0.305: HOST.CH1B 40.01,48.64 40.01,50.8 39.31,51.5 37.4,51.5 J2.2
  Bottom 0.406: J2.2 RXD.T
PTX
  Bottom 0.305: HOST.CH2B 38.99,52.7 J2.3
  Bottom 0.406: J2.3 TXD.T
PWR_IN  (via drill 0.38 pad 0.81)
  Top 0.813: U1.1 v31.11,13.84 C5.+ 27.94,13.21 D1.- D2.-
  Bottom 0.813: JP.11 34.8,10.16 v31.11,13.84
RED1
  Top 0.305: U6.4 10.19,20.04 9.27,20.95 9.27,26.29 RGB1.9
RED2
  Top 0.305: RGB1.10 8.76,24.26 8.76,20.57 9.95,19.39 U6.5
RED3
  Top 0.305: RGB1.11 8.26,22.23 8.26,20.19 9.71,18.74 U6.6
RED4
  Top 0.305: U6.7 9.47,18.09 6.99,20.57 RGB1.12
RED5
  Top 0.305: U6.8 7.96,17.44 RGB1.13
RED6
  Top 0.305: U6.9 7.9,16.79 RGB1.14
RED7  (via drill 0.3 pad 0.64)
  Top 0.305: U6.16 18.64,16.79 v18.8,16.64
  Bottom 0.305: RGB1.15 16.51,13.34 18.8,15.62 v18.8,16.64
RED8  (via drill 0.3 pad 0.64)
  Top 0.305: U6.17 19.52,17.44 v19.68,17.27
  Bottom 0.305: RGB1.16 9.02,12.83 16.89,12.83 19.68,15.62 v19.68,17.27
RESET  (via drill 0.3)
  Top 0.203: U2.29 28.18,33.26 32.38,37.47 ISP.3 34.92,38.73 38.73,38.73 41.27,41.27 C1.2 v42.16,42.1 | RST.- 57.66,42.74 R19.2 58.42,41.34 58.42,36.45 RESET.P$2
  Bottom 0.203: RESET.P$2 55.63,36.2 55.63,48.51 53.98,50.16 48.9,50.16 45.09,46.35 45.09,45.02 v42.16,42.1
RI
  Top 0.203: UART.5 34.54,40.89 29.72,40.89 29.68,40.94 U4.6
RTS
  Top 0.203: UART.1 37.47,43.81 37.47,41.27 36.7,40.51 32.89,40.51 31.36,38.98 U4.3
RX
  Top 0.203: R2.2 31.56,48.64 29.08,48.64 27.43,46.99 27.43,40.64 27.79,40.28 U4.5
RXING  (via drill 0.3 pad 0.64)
  Top 0.203: v58.67,47.12 RX.- | U4.23 20.49,40.94 v19.68,40.13
  Bottom 0.203: v58.67,47.12 58.67,48.64 48.39,58.93 27.94,58.93 23.62,54.61 23.62,48.39 18.54,43.31 18.54,41.27 v19.68,40.13
SCL  (via drill 0.3 pad 0.64)
  Top 0.203: J3.2 44.32,10.92 44.32,21.02 42.16,23.18 42.16,30.61 | 42.16,30.61 42.16,35.81 44.32,37.97 44.32,44.32 45.09,45.09 45.09,48.9 45.97,49.78 47.88,49.78 48.9,50.8 J2.7 | v42.42,30.61 42.16,30.61 | U2.28 28.98,30.88 27.69,29.59 v27.69,27.3
  Bottom 0.203: v27.69,27.3 27.69,28.45 29.84,30.61 v42.42,30.61
SDA  (via drill 0.3 pad 0.64)
  Top 0.203: J2.8 48.13,49.4 46.23,49.4 45.47,48.64 45.47,44.83 44.7,44.07 44.7,37.72 42.55,35.56 42.55,31.62 43.31,30.86 v43.31,30.35 42.55,29.59 42.55,23.37 44.7,21.21 44.7,11.18 48.26,7.62 50.16,7.62 J3.1 | U2.27 29.77,31.05 28.32,29.59 v28.32,28.07
  Bottom 0.203: v43.31,30.35 42.8,29.84 29.72,29.84 28.32,28.45 v28.32,28.07
TX
  Top 0.203: R1.2 31.43,49.02 28.83,49.02 27.05,47.24 27.05,44.32 25.91,43.18 25.91,39.5 27.72,37.69 U4.1
TXING  (via drill 0.3 pad 0.64)
  Top 0.203: v58.67,45.47 TX.- | U4.22 20.25,41.59 v19.68,41.02
  Bottom 0.203: v58.67,45.47 57.91,46.23 57.91,48.77 48.13,58.55 28.19,58.55 24,54.36 24,48.13 18.92,43.05 18.92,41.78 v19.68,41.02
URX
  Top 0.203: R2.1 33.21,48.64 37.47,48.64 HOST.COM1
UTX
  Top 0.203: R1.1 33.21,49.15 37.47,49.15 HOST.COM2
VCC1
  Top 0.61: Q5.4 52.38,11.12 RGB1.17
VCC2
  Top 0.61: Q5.6 52.38,13.02 RGB1.18
VCC3
  Top 0.61: Q4.4 52.38,16.2 RGB1.19
VCC4
  Top 0.61: Q4.6 52.38,18.09 RGB1.20
VCC5
  Top 0.61: Q3.4 52.38,41.59 RGB1.29
VCC6
  Top 0.61: Q3.6 52.38,43.49 RGB1.30
VCC7
  Top 0.61: Q2.4 52.38,46.67 RGB1.31
VCC8
  Top 0.61: Q2.6 52.38,48.58 RGB1.32
VCC_CASCADE  (via drill 0.3 pad 0.64)
  other vias: 6.99,53.34 5.71,52.7 4.45,52.07 3.17,51.44 6.99,52.07 5.71,51.44 4.45,50.8 3.17,50.16 6.99,6.35 5.71,6.99 4.45,7.62 3.17,8.26 6.99,7.62 5.71,8.26 4.45,8.89 3.17,9.53
  pour Top (isolate 0.254, no thermals): 11.43,8.89 12.06,9.53 14.61,9.53 14.61,8.26 12.7,6.35 12.7,0 0,0 0,59.69 12.7,59.69 12.7,54.61 8.89,50.8 6.35,50.8 5.08,49.53 5.08,10.16 6.35,8.89
  pour Bottom (isolate 0.254, no thermals): 7.62,7.62 12.7,7.62 12.7,0 0,0 0,59.69 12.7,59.69 12.7,54.61 8.89,50.8 6.35,50.8 5.71,50.16 5.71,9.53
XTAL1
  Top 0.305: U2.7 23.53,25.94 23.05,25.46 C2.2 20.89,25.46 20.32,26.04 X1.2
XTAL2
  Top 0.305: U2.8 24,25.14 23.18,24.32 C4.2 21.4,24.32 X1.1

### Text on the board
tPlace: DTR | RXD | TXD | 5V | CTS | GND | SCL | SDA | VCC | GND | 1 | 1 | USB | VCC | 4 | BLUE | 1 | 1 | 8 | 1 | D3 | GREEN | D2 | A7 | 8 | A6 | RED | 5 | A3 | A2 | VCC | A1 | 8 | 8 | A0 | VCC | GND | DTR | TX | RX | 5V | GND | SCL | SDA
bPlace: 6.5~9V | 5V | CTS | GND | SCL | SDA | VIN | VIN | GND | GND | 1 | 1 | CTS | DSR | RTS | DRIVE | DCD | RI | DTR | 4 | BLUE | 1 | SO | RST | SCK | GND | SI | DTR | 8 | 1 | GREEN | CC | v3.0b | Rainbowduino | 8 | 25/08/2011 by Albert | RED | 5 | www.seeedstudio.com | DRIVE | Vin | Drive | 5V | 8 | 8 | 6.5~9V | VIN | VIN | GND | GND | 5V | Only | 6.5~9V | DTR | TXD | RXD | GND | GND | SCL | SDA
Reference: 1 | 1 | VCC | 4 | BLUE | 1 | 8 | 1 | GREEN | 8 | RED | 5 | VCC | 8 | 8